# EasyEDA schematic custom_numpad.json
TITLE: Sheet_1; REV: 1.0; Date: 2021-06-17; Sheet: 1/1; Drawn By: Lâm Nghị Đinh; Company: Your Company
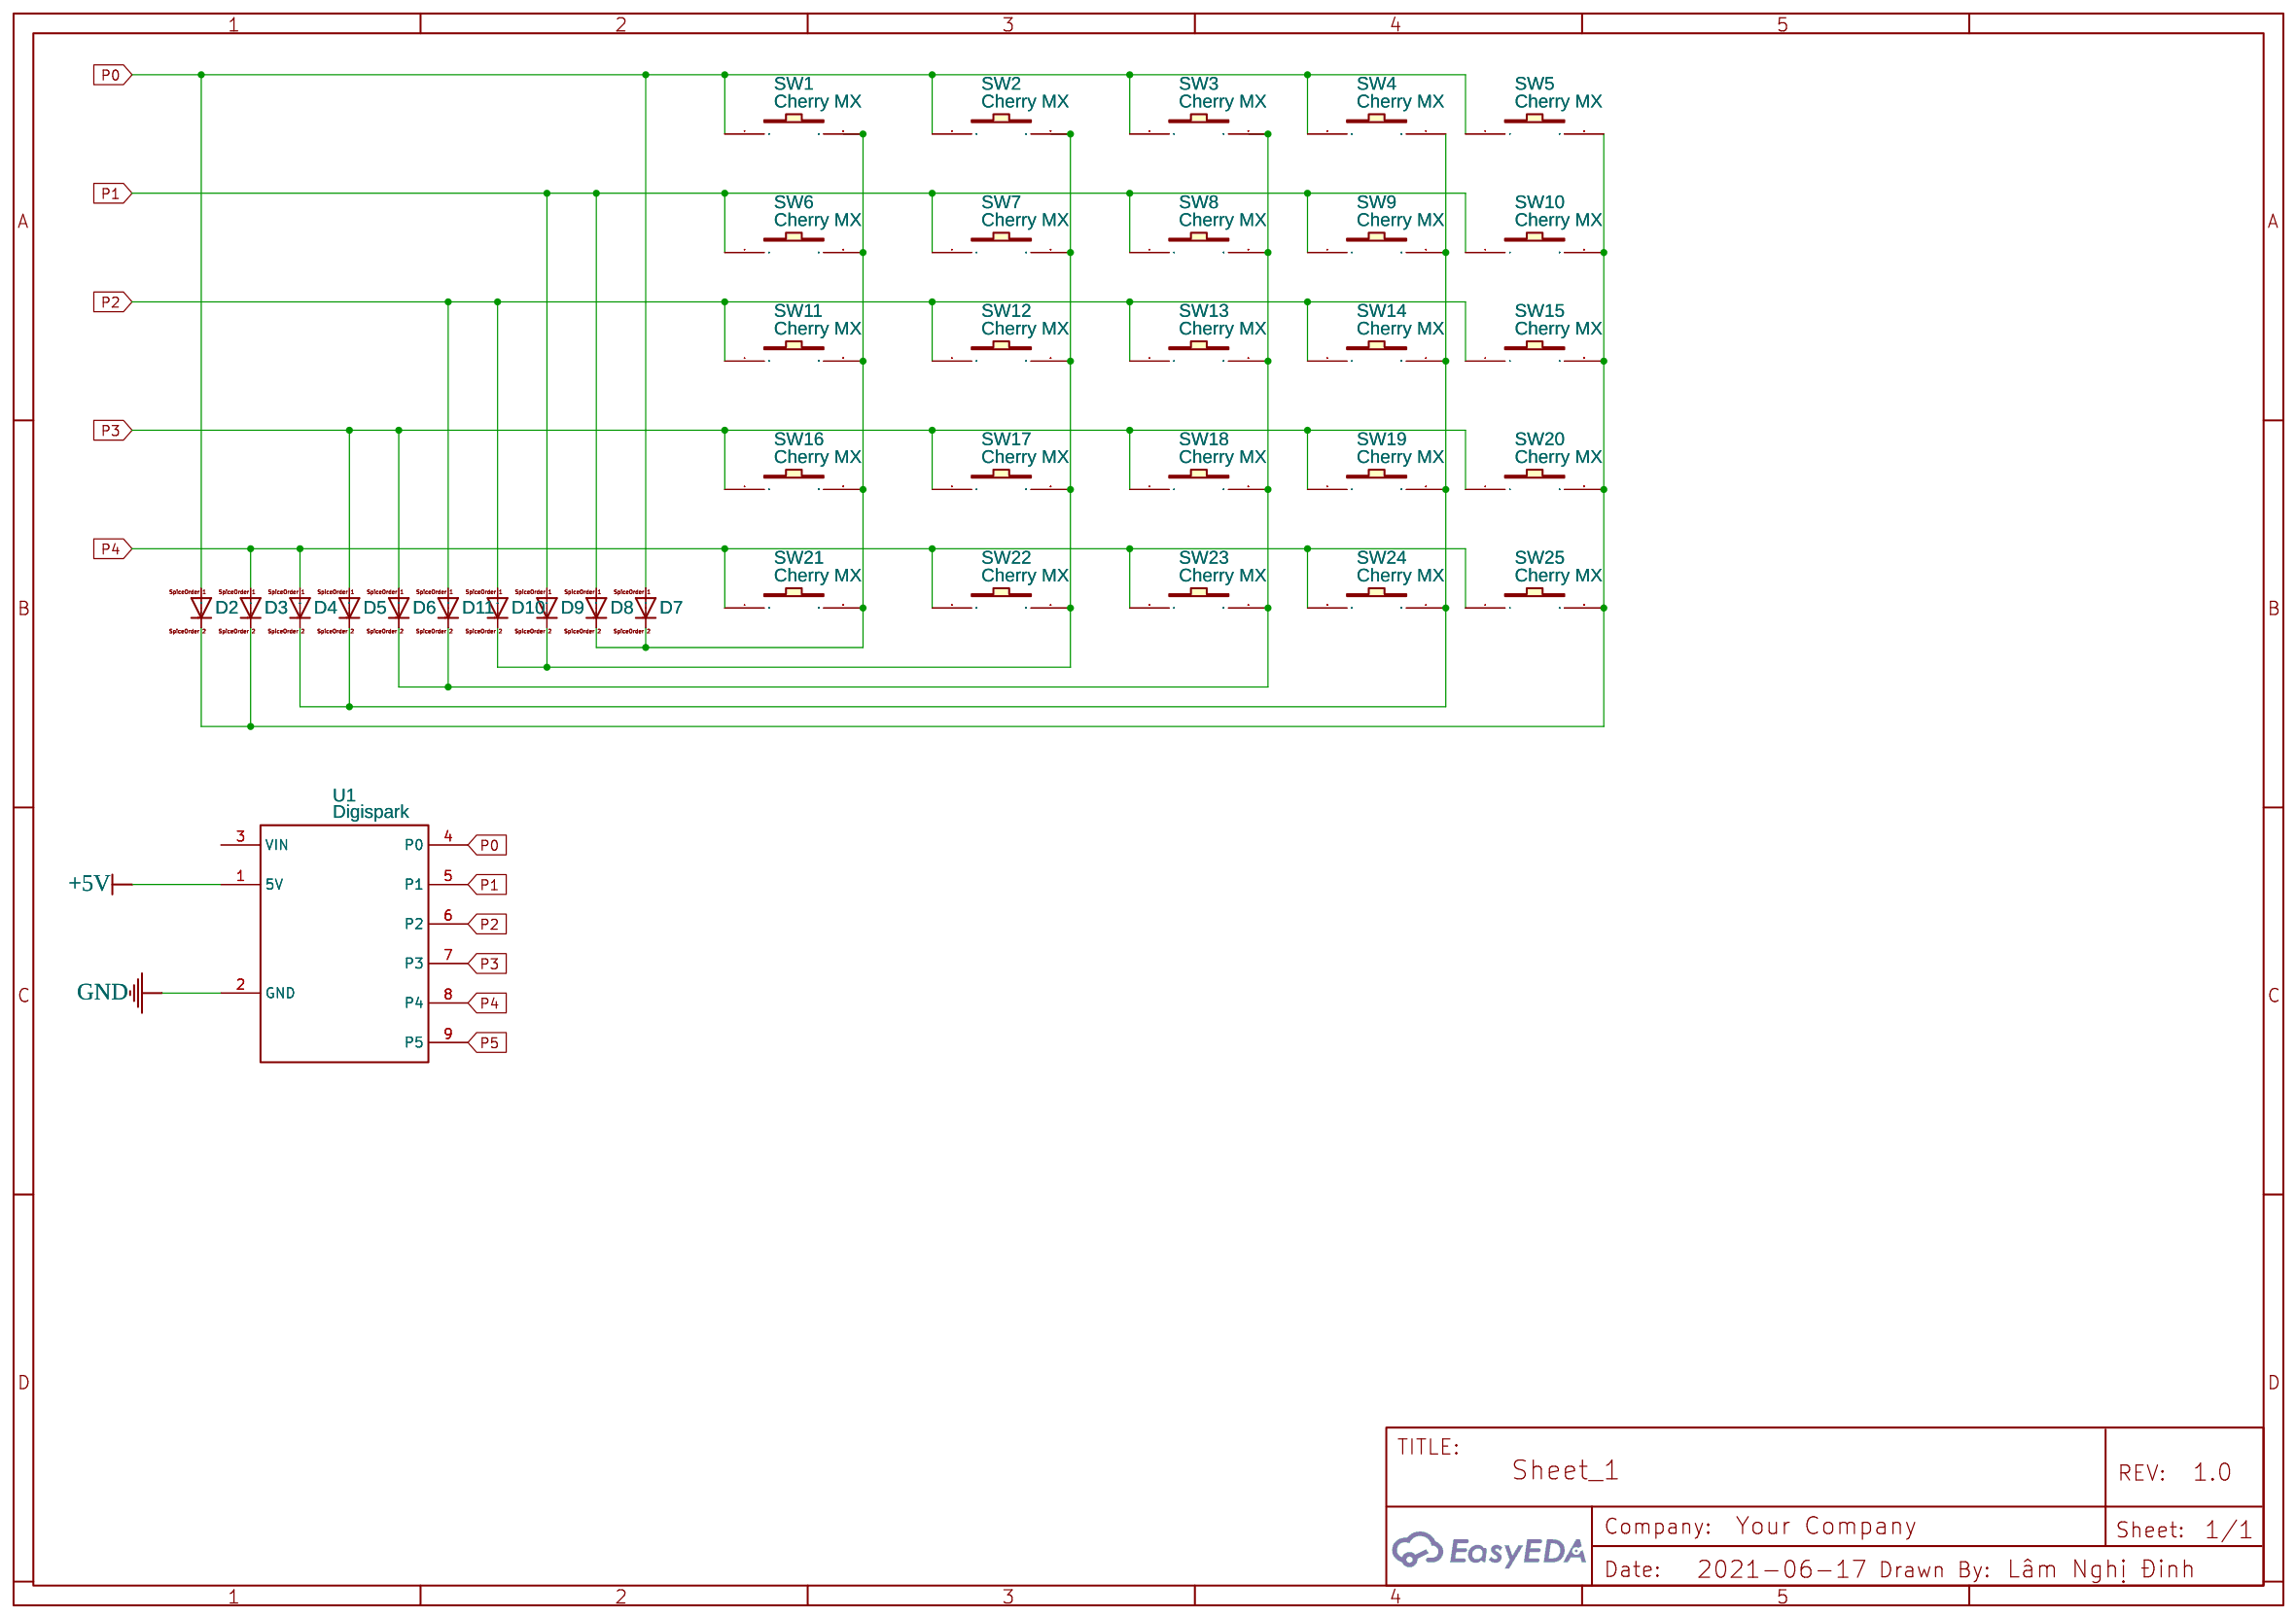
[diagram p0: schematic sheet]

## Parts
D2  1N4148DO35-7  [DO35-7]
D3  1N4148DO35-7  [DO35-7]
D4  1N4148DO35-7  [DO35-7]
D5  1N4148DO35-7  [DO35-7]
D6  1N4148DO35-7  [DO35-7]
D7  1N4148DO35-7  [DO35-7]
D8  1N4148DO35-7  [DO35-7]
D9  1N4148DO35-7  [DO35-7]
D10  1N4148DO35-7  [DO35-7]
D11  1N4148DO35-7  [DO35-7]
SW1  Cherry MX  [CHERRY MX 1U]
SW2  Cherry MX  [CHERRY MX 1U]
SW3  Cherry MX  [CHERRY MX 1U]
SW4  Cherry MX  [CHERRY MX 1U]
SW5  Cherry MX  [CHERRY MX 1U]
SW6  Cherry MX  [CHERRY MX 1U]
SW7  Cherry MX  [CHERRY MX 1U]
SW8  Cherry MX  [CHERRY MX 1U]
SW9  Cherry MX  [CHERRY MX 1U]
SW10  Cherry MX  [CHERRY MX 1U]
SW11  Cherry MX  [CHERRY MX 1U]
SW12  Cherry MX  [CHERRY MX 1U]
SW13  Cherry MX  [CHERRY MX 1U]
SW14  Cherry MX  [CHERRY MX 1U]
SW15  Cherry MX  [CHERRY MX 1U]
SW16  Cherry MX  [CHERRY MX 1U]
SW17  Cherry MX  [CHERRY MX 1U]
SW18  Cherry MX  [CHERRY MX 1U]
SW19  Cherry MX  [CHERRY MX 1U]
SW20  Cherry MX  [CHERRY MX 1U]
SW21  Cherry MX  [CHERRY MX 1U]
SW22  Cherry MX  [CHERRY MX 1U]
SW23  Cherry MX  [CHERRY MX 1U]
SW24  Cherry MX  [CHERRY MX 1U]
SW25  Cherry MX  [CHERRY MX 1U]
U1  Digispark  [DIGISPARK]

## Library data of the parts
D2-D11 = 1N4148DO35-7: DIODE
SW1-SW25 = Cherry MX
U1 = Digispark: Manufacturer: HiLetgo; Manufacturer Part: IMP1117AD33/T; image: //image.lceda.cn/szlcsc/C72865.jpg; Supplier Part: C72865; LCSC Assembly: Yes; SMT Type: Extend; link: https://ja.aliexpress.com/item/32832106915.html?spm=a2g0o.productlist.0.0.646810f3j1Zjkz&s=p&ad_pvid=202005010736151003035241326600006675230_1&algo_pvid=a899a355-b5c0-45c9-ba65-a62d1f2381e7&algo_expid=a899a355-b5c0-45c9-ba65-a62d1f2381e7-0&btsid=0ab6d69f15883437749944275e4c9c&ws_ab_test=searchweb0_0,searchweb201602_,searchweb201603_; Contributor: KDSmenber

## Nets
+5V: U1.1(5V)
GND: U1.2(GND)
P0: D2.A D7.A SW1.1 SW2.1 SW3.1 SW4.1 SW5.1 U1.4(P0)
P1: D8.A D9.A SW6.1 SW7.1 SW8.1 SW9.1 SW10.1 U1.5(P1)
P2: D10.A D11.A SW11.1 SW12.1 SW13.1 SW14.1 SW15.1 U1.6(P2)
P3: D5.A D6.A SW16.1 SW17.1 SW18.1 SW19.1 SW20.1 U1.7(P3)
P4: D3.A D4.A SW21.1 SW22.1 SW23.1 SW24.1 SW25.1 U1.8(P4)
P5: U1.9(P5)
Net-(D2-C): D2.C D3.C SW5.2 SW10.2 SW15.2 SW20.2 SW25.2
Net-(D4-C): D4.C D5.C SW4.2 SW9.2 SW14.2 SW19.2 SW24.2
Net-(D6-C): D6.C D11.C SW3.2 SW8.2 SW13.2 SW18.2 SW23.2
Net-(D7-C): D7.C D8.C SW1.2 SW6.2 SW11.2 SW16.2 SW21.2
Net-(D9-C): D9.C D10.C SW2.2 SW7.2 SW12.2 SW17.2 SW22.2

Not connected (* = marked no-connect by the designer): U1 3(VIN)
